# EAGLE design Addon-mapleCUx_OneWire-RS485-007 (EAGLE 7.6.0)
MAPLE-CUx Large Version
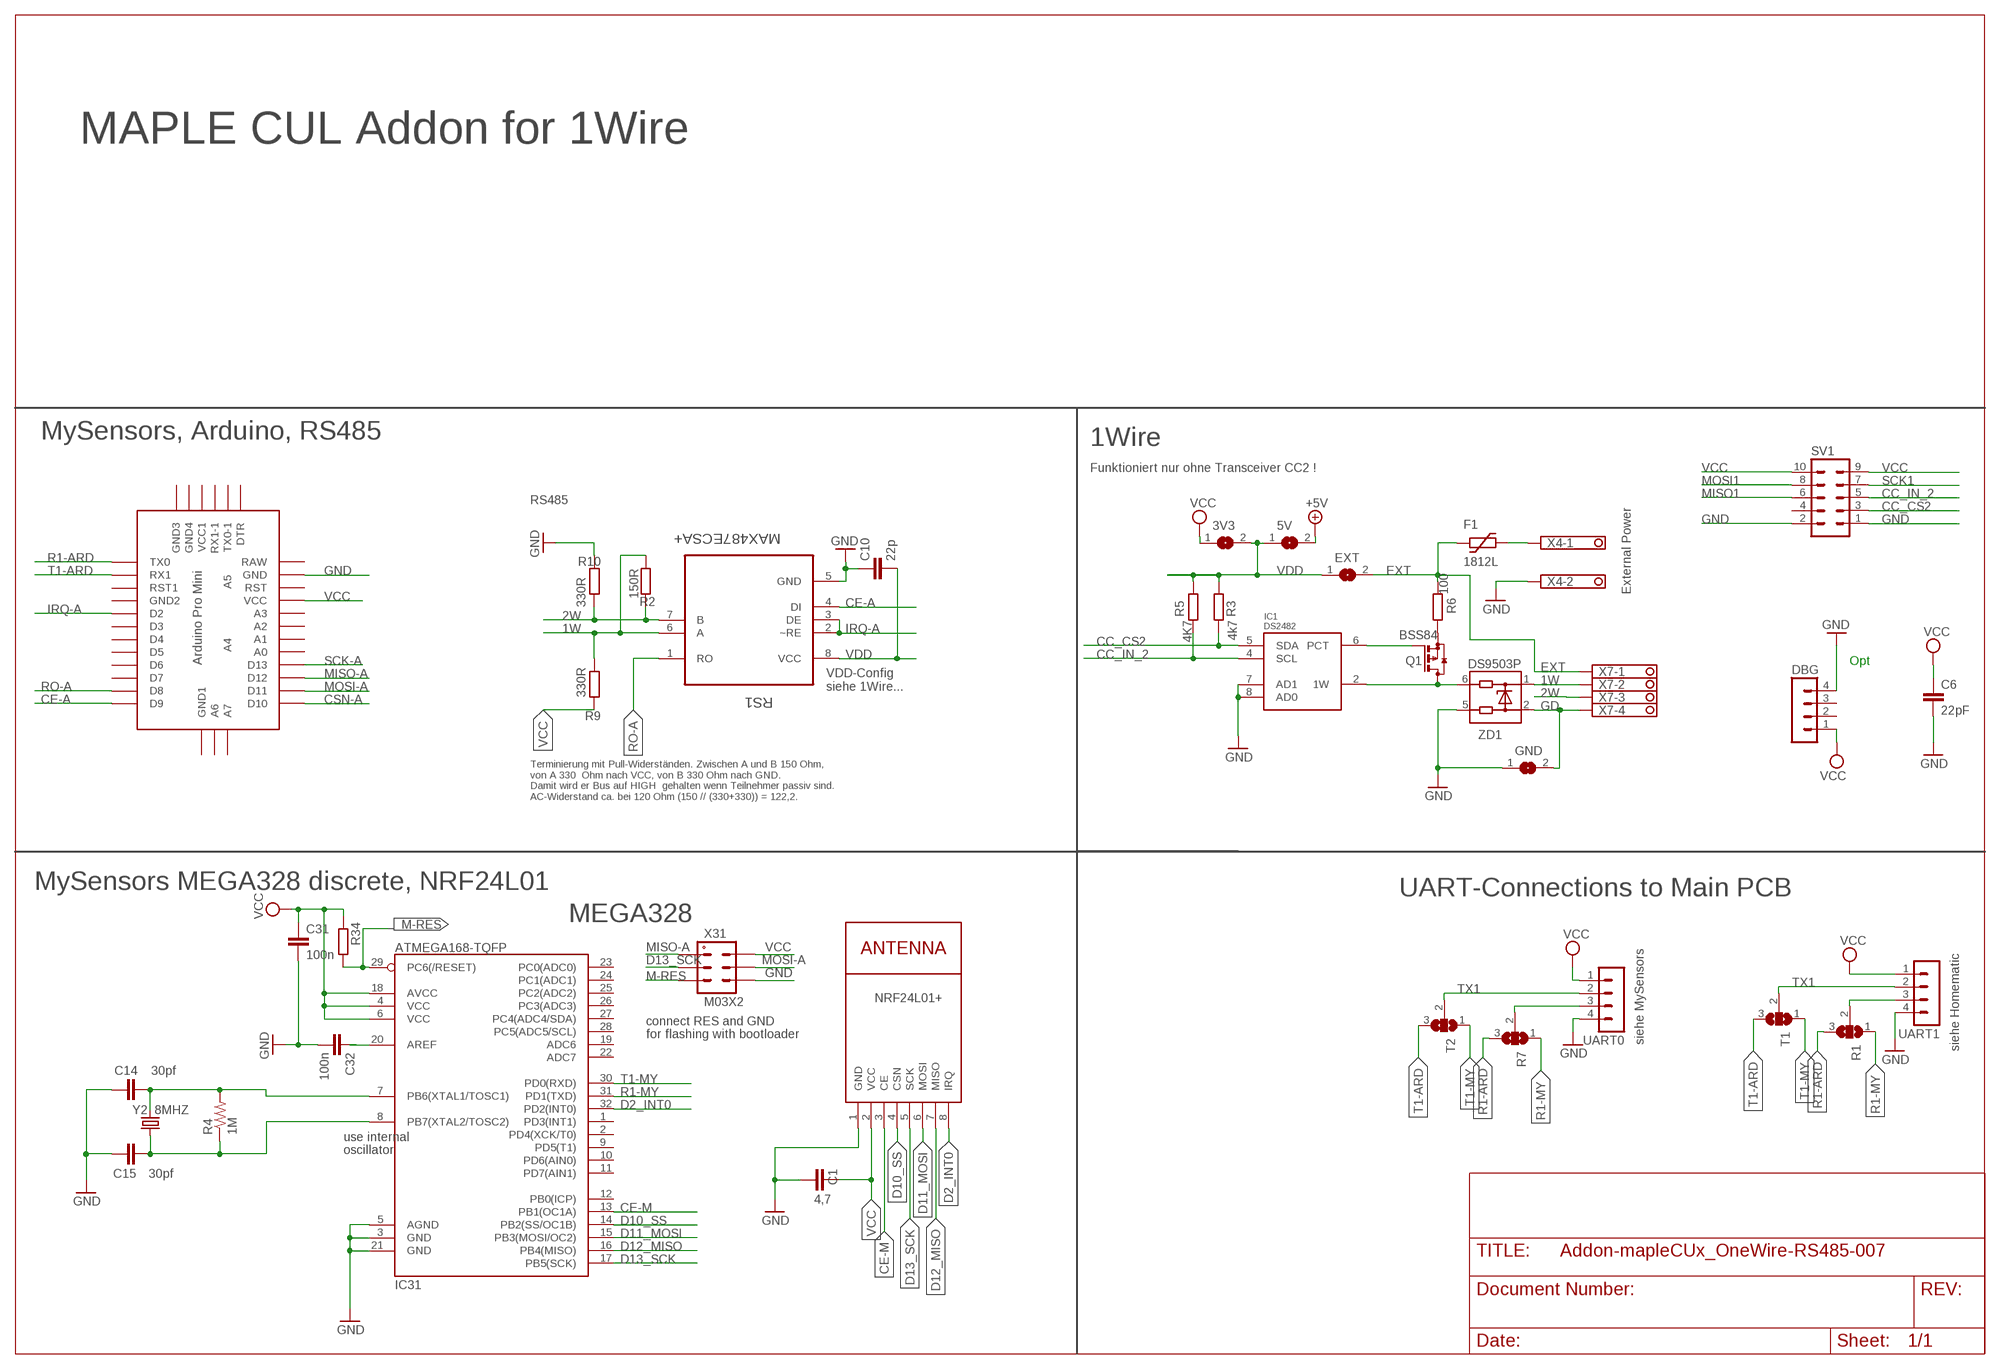
[diagram p0: schematic, sheet 1]

## Parts
3V3  SJ  [SJ]
5V  SJ  [SJ]
C1  4,7  C-EUC1210  [C1210]
C6  22pF  C-EUC0805  [C0805]
C10  22p  C-EUC0805  [C0805]
C14  30pf  CAP0805  [0805]
C15  30pf  CAP0805  [0805]
C31  100n  C-EUC0805  [C0805]
C32  100n  C-EUC0805  [C0805]
DBG  MA04-1  [MA04-1]
EXT  SJ  [SJ]
F1  1812L  [1812L]
GND  SJ  [SJ]
IC1  DS2482  DS2482-100S  [SO08]
IC31  ATMEGA168-TQFP  [TQFP32-08]
NRF24L01+  NRF24L01+  WIRELESS-NRF24L01  [WIRELESS-NRF24L01]
Q1  BSS84  [SOT23]
R1  SJ2W  [SJ_2]
R2  150R  R-EU_R0805  [R0805]
R3  4k7  R-EU_R0805  [R0805]
R4  1M  RESISTOR0805-RES  [0805]
R5  4K7  R-EU_R0805  [R0805]
R6  100  R-EU_R0805  [R0805]
R7  SJ2W  [SJ_2]
R9  330R  R-EU_R0805  [R0805]
R10  330R  R-EU_R0805  [R0805]
R34  R-EU_R0805  [R0805]
RS1  MAX487ECSA+  [SOIC127P600X175-8N]
SV1  MA05-2  [MA05-2]
T1  SJ2W  [SJ_2]
T2  SJ2W  [SJ_2]
U$1  ABK-PRO-MINI  [ABK-PRO-MINI]
UART0  MA04-1  [MA04-1]
UART1  MA04-1  [MA04-1]
X4  1751248  [1751248]
X7  1751264  [1751264]
X31  M03X2  [2X03-1.27MM_SMD]
Y2  8MHZ  CRYSTALTXC-7A  [CRYSTAL-TXC-7A]
ZD1  DS9503P  [TSOC6]

## Nets
1W: R2.1 R9.2 RS1.6(A) X7.2 ZD1.1
2W: R2.2 R10.1 RS1.7(B) X7.3
+5V [PWR]: 5V.2
CC_CS2: IC1.5(SDA) R3.2 SV1.3
CC_IN_2: IC1.4(SCL) R5.2 SV1.5
CE-A: RS1.4(DI) U$1.D9
CE-M: IC31.13(PB1(OC1A)) NRF24L01+.3(CE)
CSN-A: U$1.D10
D2_INT0: IC31.32(PD2(INT0)) NRF24L01+.8(IRQ)
D10_SS: IC31.14(PB2(SS/OC1B)) NRF24L01+.4(CSN)
D11_MOSI: IC31.15(PB3(MOSI/OC2)) NRF24L01+.6(MOSI)
D12_MISO: IC31.16(PB4(MISO)) NRF24L01+.7(MISO)
D13_SCK: IC31.17(PB5(SCK)) NRF24L01+.5(SCK) X31.P$3
EXT [PWR]: EXT.2 F1.P$1 R6.2 X7.1
GD [PWR]: GND.2 X7.4 ZD1.2
GND [PWR]: C1.1 C6.2 C10.1 C14.1 C15.1 C31.2 C32.2 DBG.4 GND.1 IC1.7(AD1) IC1.8(AD0) IC31.3(GND) IC31.5(AGND) IC31.21(GND) NRF24L01+.1(GND) R10.2 RS1.5(GND) SV1.1 SV1.2 U$1.GND UART0.4 UART1.4 X4.2 X31.P$6 ZD1.5
IRQ-A: RS1.2(~RE) RS1.3(DE) U$1.D2
M-RES: IC31.29(PC6(/RESET)) R34.2 X31.P$5
MISO1: SV1.6
MISO-A: U$1.D12 X31.P$1
MOSI1: SV1.8
MOSI-A: U$1.D11 X31.P$4
N$3: C14.2 IC31.7(PB6(XTAL1/TOSC1)) R4.2 Y2.P$2
N$13: C32.1 IC31.20(AREF)
N$19: C15.2 IC31.8(PB7(XTAL2/TOSC2)) R4.1 Y2.P$1
N$45 [PWR]: F1.P$2 X4.1
N$47: IC1.6(PCT) Q1.1(G)
N$48: IC1.2(1W) Q1.3(D) ZD1.6
N$52: Q1.2(S) R6.1
R1-ARD: R1.3 R7.3 U$1.TX0
R1-MY: IC31.31(PD1(TXD)) R1.1 R7.1
RO-A: RS1.1(RO) U$1.D8
RX1: R1.2 R7.2 UART0.3 UART1.3
SCK1: SV1.7
SCK-A: U$1.D13
T1-ARD: T1.3 T2.3 U$1.RX1
T1-MY: IC31.30(PD0(RXD)) T1.1 T2.1
TX1: T1.2 T2.2 UART0.2 UART1.2
VCC [PWR]: 3V3.1 C1.2 C6.1 C31.1 DBG.1 IC31.4(VCC) IC31.6(VCC) IC31.18(AVCC) R9.1 R34.1 SV1.9 SV1.10 U$1.VCC UART0.1 UART1.1 X31.P$2
VDD [PWR]: 3V3.2 5V.1 C10.2 EXT.1 R3.1 R5.1 RS1.8(VCC)
Unconnected: DBG.2 DBG.3 IC31.1(PD3(INT1)) IC31.2(PD4(XCK/T0)) IC31.9(PD5(T1)) IC31.10(PD6(AIN0)) IC31.11(PD7(AIN1)) IC31.12(PB0(ICP)) IC31.19(ADC6) IC31.22(ADC7) IC31.23(PC0(ADC0)) IC31.24(PC1(ADC1)) IC31.25(PC2(ADC2)) IC31.26(PC3(ADC3)) IC31.27(PC4(ADC4/SDA)) IC31.28(PC5(ADC5/SCL)) SV1.4 U$1.A0 U$1.A1 U$1.A2 U$1.A3 U$1.A4 U$1.A5 U$1.A6 U$1.A7 U$1.D3 U$1.D4 U$1.D5 U$1.D6 U$1.D7 U$1.DTR U$1.GND1(GND2) U$1.GND2(GND3) U$1.GND3(GND4) U$1.GND4(GND1) U$1.RAW U$1.RST U$1.RST1 U$1.RX1-1 U$1.TX0-1 U$1.VCC1

## Notes on the sheet
- MAPLE CUL Addon for 1Wire
- MySensors, Arduino, RS485 | 1Wire
- Funktioniert nur ohne Transceiver CC2 !
- RS485
- External Power
- Opt
- VDD-Config
  siehe 1Wire...
- Terminierung mit Pull-Widerständen. Zwischen A und B 150 Ohm,
  von A 330  Ohm nach VCC, von B 330 Ohm nach GND. 
  Damit wird er Bus auf HIGH  gehalten wenn Teilnehmer passiv sind.
  AC-Widerstand ca. bei 120 Ohm (150 // (330+330)) = 122,2.
- MySensors MEGA328 discrete, NRF24L01 | UART-Connections to Main PCB
- MEGA328
- connect RES and GND
- for flashing with bootloader
- siehe MySensors
- siehe Homematic
- use internal
- oscillator

## Power pins joined to a net without a drawn wire
GND: IC1.3(GND)
VCC: NRF24L01+.2(VCC)
VDD: IC1.1(VDD)

## Library data of the parts
3V3 5V EXT GND = jumper:SJ: SMD solder JUMPER
C1 C6 C10 C31 C32 = rcl:C-EU: CAPACITOR, European symbol
C14 C15 = doug:CAP: Capacitor Standard 0603 ceramic capacitor, and 0.1" leaded capacitor.
DBG UART0 UART1 = con-lstb:MA04-1: PIN HEADER; OC_FARNELL: unknown; OC_NEWARK: unknown
F1 = ptc-littlefuse:1812L
IC1 = 1wire:DS2482-100: I2C to 1-Wire Host Adapter/Line Driver This device is a onewire host and I2C interface in one chip. It provides the complete DC/AC requirements for onewire communication, including overdrive speed mode, but, unlike the DS2480B chip, no 12V EPROM programming. Notes: For overdrive speed and 5V EEPROM programming, an external active pullup circuit must be connected to the 1W, VDD and PCT pin. See the datasheet for details. The lower two I2C adress bits of the chip can be selected by external pins, so up to 4 chips may be connected to the same I2C bus. Author: Orginal device and description from Giovanni Varasano <giovanni.varasano@fastwebnet.it> Improved by Jan Kandziora <jjj@gmx.de>
IC31 = atmel:ATMEGA168: Atmel Atmega 168/328/328P
NRF24L01+ = diy-modules:WIRELESS-NRF24L01: 2.4 GHz Wireless Module based on NRF24L01 chip
Q1 = transistor-small-signal:BSS84: P-CHANNEL MOS FET
R1 R7 T1 T2 = jumper:SJ2W: SMD solder JUMPER
R2 R3 R5 R6 R9 R10 R34 = rcl:R-EU_: RESISTOR, European symbol
R4 = doug:RESISTOR: Resistor Basic schematic elements and footprints for 0603, 1206, and PTH resistors.
RS1 = Maxim_By_element14_Batch_1:MAX487ECSA+: Low-Power, Slew-Rate-Limited RS-485/RS-422 Transceivers; MPN: MAX487ECSA+; OC_FARNELL: 9724532; OC_NEWARK: 68K4803; PACKAGE: SOIC-8; SUPPLIER: Maxim
SV1 = con-lstb:MA05-2: PIN HEADER; OC_FARNELL: unknown; OC_NEWARK: unknown
U$1 = Arduino-clone:ABK-PRO-MINI: ABK Pro-Mini Arduino Clone
X4 = con-phoenix-350:1751248: MKDS 1/ 2-3,5 Printklemme Nennstrom: 10 A Bemessungsspannung: 160 V Raster: 3,5 mm Polzahl: 2 Montageart: Löten Anschlussart: Schraubanschluss Anschlussrichtung vom Leiter zur Platine: 0° Source: http://eshop.phoenixcontact.com .. 1751248.pdf; OC_FARNELL: unknown; OC_NEWARK: unknown
X7 = con-phoenix-350:1751264: MKDS 1/ 4-3,5 Printklemme Nennstrom: 10 A Bemessungsspannung: 160 V Raster: 3,5 mm Polzahl: 4 Montageart: Löten Anschlussart: Schraubanschluss Anschlussrichtung vom Leiter zur Platine: 0° Source: http://eshop.phoenixcontact.com .. 1751264.pdf; MPN: 1751264; OC_FARNELL: unknown; OC_NEWARK: 10R0934
X31 = mechanics:M03X2
Y2 = SparkFun-FreqCtrl:CRYSTAL: Various standard crystals. Proven footprints.
ZD1 = 1wire:DS9503: ESD Protection Diode with Resistors This ESD protection diode is designed especially for onewire host interfaces. Unlike the DS9502, it has two additional 5Ohm resitors in the 1W and GND line. Pin 5 and 6 have to be connected to the host side, pin 1 und 2 to the network side. The 1W line is through pin 1 and 6, the GND line is through pin 2 and 5. Author: Jan Kandziora <jjj@gmx.de>

## Net classes
0 default: width 0.305 mm
1 PWR: width 0.457 mm

## Board
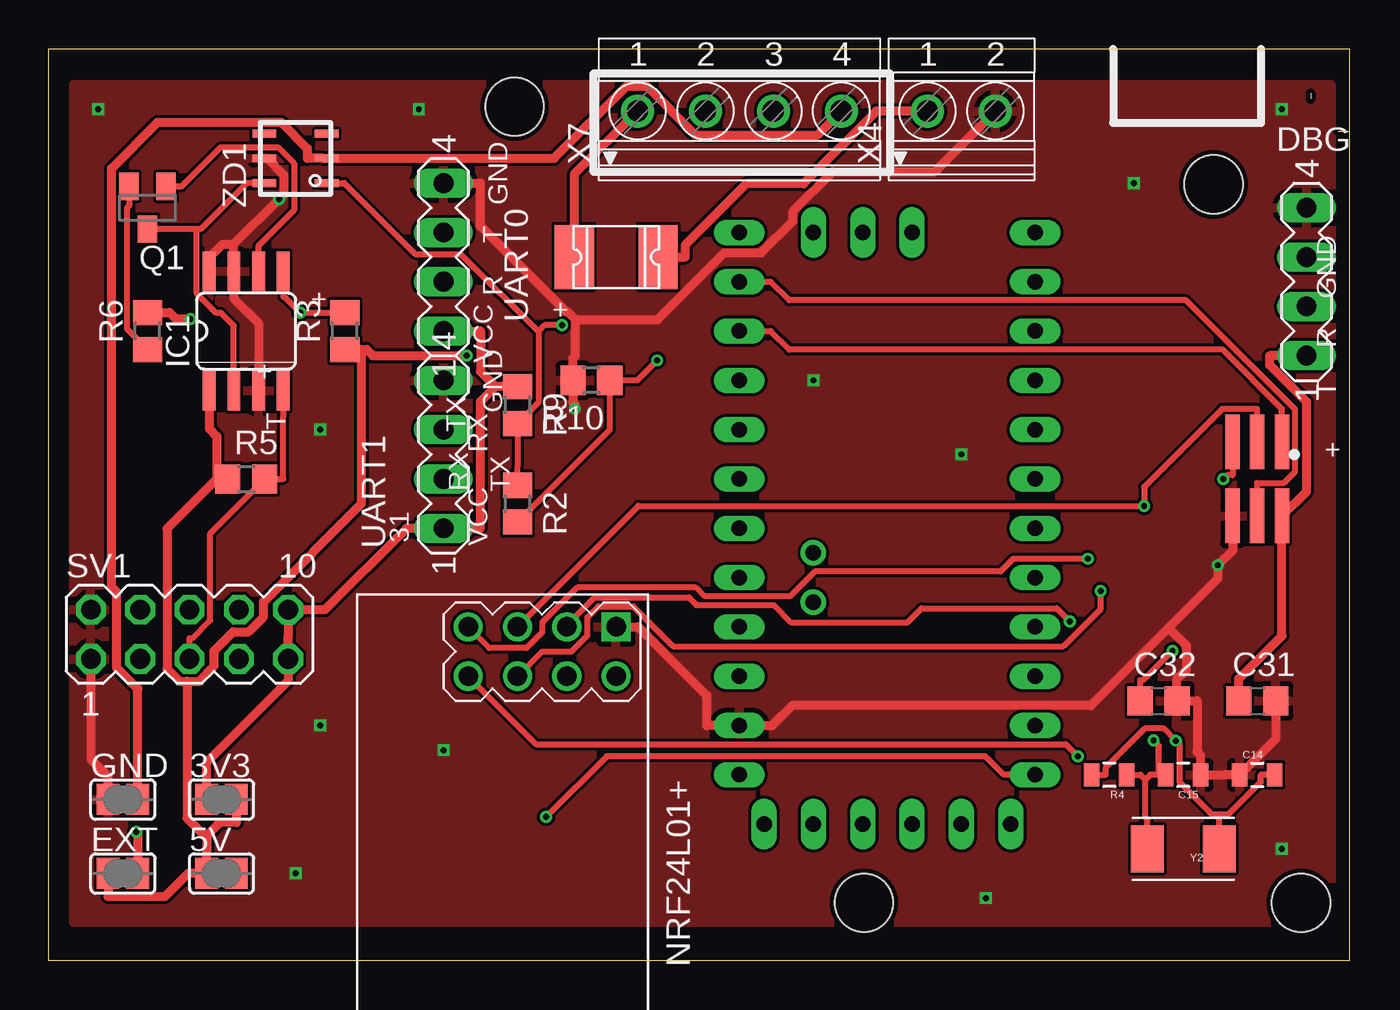
[diagram p1: board, top side]
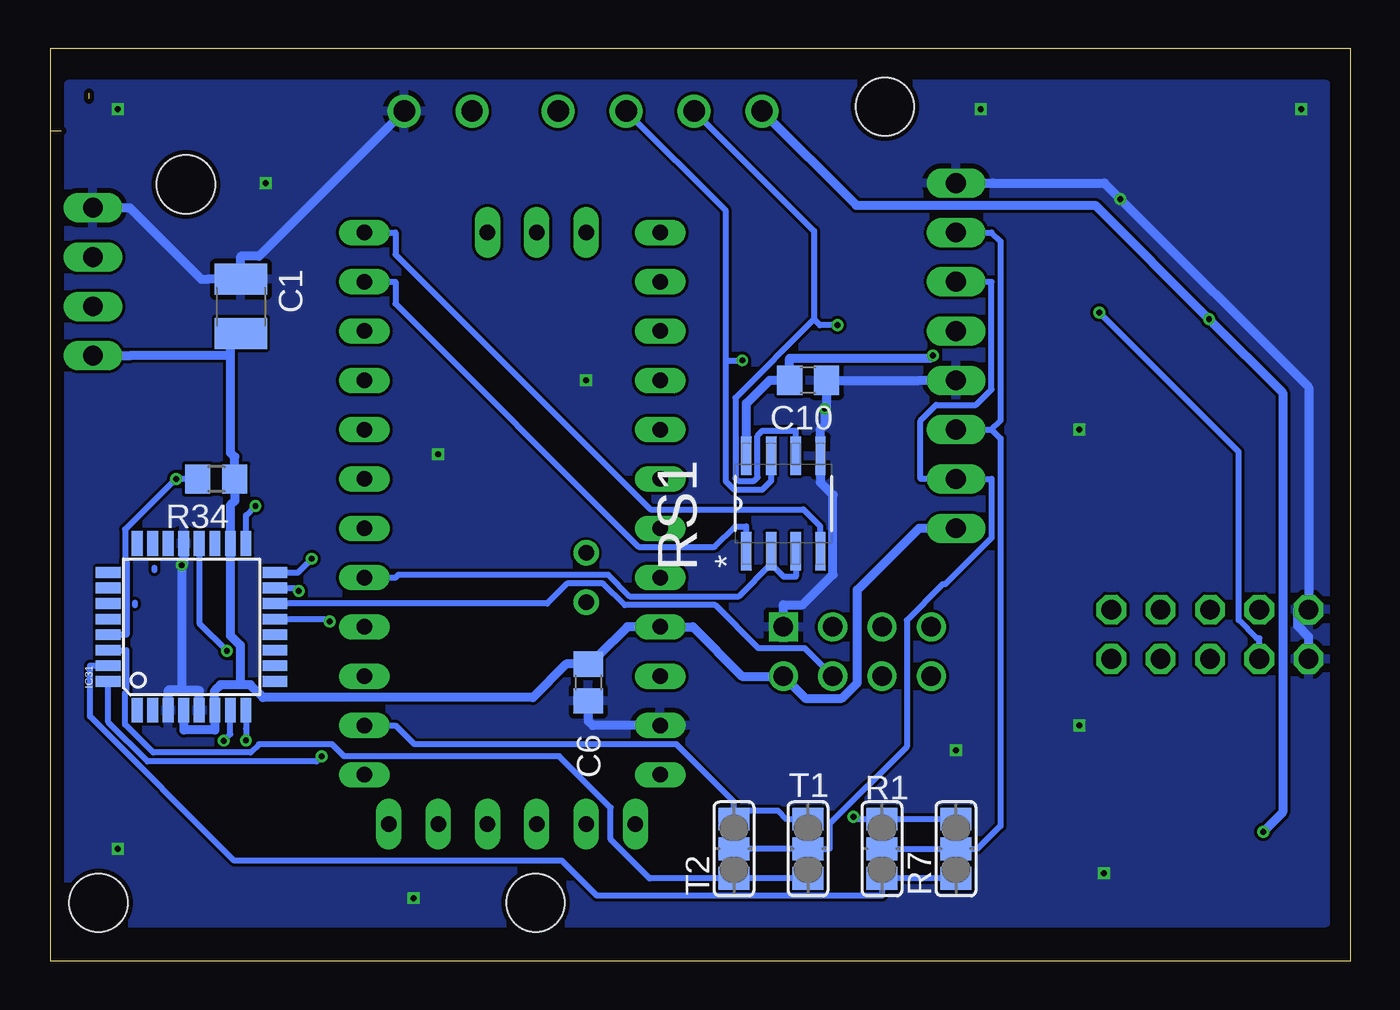
[diagram p2: board, bottom side, seen from below]

Size 67 x 47 mm. Coordinates in mm from the lower left corner, seen from the top.
Outline: 67,47 67,46.24
Outline: 65,44.7 65,44.41
Outline: 66.41,42.75 67,42.75
Outline: 67,47 0,47 0,0 67,0 67,42.75
Outline: 67,47 67,42.75
Copper layers (1*16): Top 0.035mm / dielectric 1.5mm / Bottom 0.035mm
Design rules "SeeedStudio_2layer_DRU_no_angle_20140221": minimum track width 6mil, minimum drill 12mil, track to track 6mil, track to pad 6mil, pad to pad 6mil, via to via 6mil, smd to smd 0mil, copper to edge 10mil, drill to drill 10mil, minimum pad ring 10mil, minimum via ring 6mil, stop-mask expansion 2mil, vias tented up to drill 100mil, thermal gap 10mil
Holes 3 mm at 60,40 24,44 42,3 64.5,3

### Footprints (pad centres in the part's own frame; a part is rotated, then mirrored left to right if it is on the bottom)
SJ = smd 1.168 x 1.6: 1 -0.762,0; 2 0.762,0
C1210 = smd 1.6 x 2.7: 1 -1.4,0; 2 1.4,0
C0805 = smd 1.3 x 1.5: 1 -0.95,0; 2 0.95,0
0805 = smd 0.8 x 1.2: 1 -0.9,0; 2 0.9,0
MA04-1 = drill 1.016 long: 1 -3.81,0; 2 -1.27,0; 3 1.27,0; 4 3.81,0
1812L = smd 2.03 x 3.3: P$1 -2.16,0; P$2 2.16,0
SO08 = smd 0.66 x 2.032: 1 -1.905,-3.073; 2 -0.635,-3.073; 3 0.635,-3.073; 4 1.905,-3.073; 5 1.905,3.073; 6 0.635,3.073; 7 -0.635,3.073; 8 -1.905,3.073
TQFP32-08 = smd 1.27 x 0.559: 1 -4.293,2.8; 2 -4.293,2; 3 -4.293,1.2; 4 -4.293,0.4; 5 -4.293,-0.4; 6 -4.293,-1.2; 7 -4.293,-2; 8 -4.293,-2.8; 17 4.293,-2.8; 18 4.293,-2; 19 4.293,-1.2; 20 4.293,-0.4; 21 4.293,0.4; 22 4.293,1.2; 23 4.293,2; 24 4.293,2.8 | smd 0.559 x 1.27: 9 -2.8,-4.293; 10 -2,-4.293; 11 -1.2,-4.293; 12 -0.4,-4.293; 13 0.4,-4.293; 14 1.2,-4.293; 15 2,-4.293; 16 2.8,-4.293; 25 2.8,4.293; 26 2,4.293; 27 1.2,4.293; 28 0.4,4.293; 29 -0.4,4.293; 30 -1.2,4.293; 31 -2,4.293; 32 -2.8,4.293
WIRELESS-NRF24L01 = drill 1 square: 1 -12.7,6.35 | drill 1: 2 -10.16,6.35; 3 -12.7,3.81; 4 -10.16,3.81; 5 -12.7,1.27; 6 -10.16,1.27; 7 -12.7,-1.27; 8 -10.16,-1.27
SOT23 = smd 1 x 1.4: 1 -0.95,-1.1; 2 0.95,-1.1; 3 0,1.1
SJ_2 = smd 1.168 x 1.6: 1 -1.524,0; 2 0,0; 3 1.524,0
R0805 = smd 1.3 x 1.5: 1 -0.95,0; 2 0.95,0
SOIC127P600X175-8N = smd 1.981 x 0.533: 1 -2.464,1.905; 2 -2.464,0.635; 3 -2.464,-0.635; 4 -2.464,-1.905; 5 2.464,-1.905; 6 2.464,-0.635; 7 2.464,0.635; 8 2.464,1.905
MA05-2 = drill 1.016 octagon: 1 -5.08,-1.27; 2 -5.08,1.27; 3 -2.54,-1.27; 4 -2.54,1.27; 5 0,-1.27; 6 0,1.27; 7 2.54,-1.27; 8 2.54,1.27; 9 5.08,-1.27; 10 5.08,1.27
ABK-PRO-MINI = drill 0.8 long: A0 10.16,-3.81; A1 10.16,-6.35; A2 10.16,-8.89; A3 10.16,-11.43; A6 3.81,-21.59; A7 6.35,-21.59; D2 -5.08,-3.81; D3 -5.08,-6.35; D4 -5.08,-8.89; D5 -5.08,-11.43; D6 -5.08,-13.97; D7 -5.08,-16.51; D8 -5.08,-19.05; D9 -5.08,-21.59; D10 10.16,-21.59; D11 10.16,-19.05; D12 10.16,-16.51; D13 10.16,-13.97; DTR 8.89,8.89; GND 10.16,3.81; GND1 -5.08,-1.27; GND2 -3.81,8.89; GND3 -1.27,8.89; GND4 1.27,-21.59; RAW 10.16,6.35; RST 10.16,1.27; RST1 -5.08,1.27; RX1 -5.08,3.81; RX1-1 3.81,8.89; TX0 -5.08,6.35; TX0-1 6.35,8.89; VCC 10.16,-1.27; VCC1 1.27,8.89 | drill 0.8: A4 6.35,-5.08; A5 6.35,-2.54
1751248 = drill 1.1 pad 1.7: 1 -1.75,-0.1; 2 1.75,-0.1
1751264 = drill 1.1 pad 1.7: 1 -5.25,-0.1; 2 -1.75,-0.1; 3 1.75,-0.1; 4 5.25,-0.1
2X03-1.27MM_SMD = smd 0.75 x 2.8: P$1 -1.27,-1.905; P$2 -1.27,1.905; P$3 0,-1.905; P$4 0,1.905; P$5 1.27,-1.905; P$6 1.27,1.905
CRYSTAL-TXC-7A = smd 1.7 x 2.4: P$1 1.85,0; P$2 -1.85,0
TSOC6 = smd 0.406 x 1.219: 1 -1.27,-1.6; 2 0,-1.6; 3 1.27,-1.6; 4 1.27,1.6; 5 0,1.6; 6 -1.27,1.6

### Placement (x,y rotation side)
3V3  8.91,8.32 0 top
5V  8.91,4.51 0 top
C1  57.17,33.72 270 bottom
C6  39.28,14.34 270 bottom
C10  27.96,29.91 180 bottom
C14  62.25,9.59 0 top
C15  58.44,9.59 180 top
C31  62.25,13.4 0 top
C32  57.17,13.4 0 top
DBG  64.79,34.99 90 top
EXT  3.83,4.51 0 top
F1  29.23,36.26 0 top
GND  3.83,8.32 0 top
IC1  10.18,32.45 0 top
IC31  59.71,17.21 90 bottom
NRF24L01+  22.88,4.51 270 top
Q1  5.1,38.8 180 top
R1  24.15,5.78 90 bottom
R2  24.15,23.56 270 top
R3  15.26,32.45 90 top
R4  54.63,9.59 180 top
R5  10.18,24.83 0 top
R6  5.1,32.45 90 top
R7  20.34,5.78 90 bottom
R9  24.15,28.64 270 top
R10  27.96,29.91 180 top
R34  58.44,24.83 180 bottom
RS1  29.23,23.56 90 bottom
SV1  7.26,16.83 0 top
T1  27.96,5.78 90 bottom
T2  31.77,5.78 90 bottom
U$1  45.74,15.94 180 top
UART0  20.34,36.26 90 top
UART1  20.34,26.1 90 top
X4  47.01,43.88 0 top
X7  35.58,43.88 0 top
X31  62.25,24.83 180 top
Y2  58.44,5.78 180 top
ZD1  12.72,41.34 90 top

### Tracks (layer width: path | path; a pad name or v marks a point on that pad's centre or on a via)
1W  (via drill 0.3 pad 0.61)
  Top 0.305: 25.23,32.43 25.23,28.77 R9.2 24.15,25.47 R2.1 | 25.23,32.43 21.23,36.42 18.88,36.42 15.23,40.07 ZD1.1 | v26.45,32.75 25.56,32.75 25.23,32.43
  Bottom 0.305: 27.66,33.05 31.71,29 31.71,24.87 31.56,24.73 30.74,24.73 30.56,24.91 30.56,27.06 30.31,27.32 28.59,27.32 RS1.6 | X7.2 27.66,37.6 27.66,33.05 | v26.45,32.75 27.35,32.75 27.66,33.05
2W  (via drill 0.3 pad 0.61)
  Top 0.305: v31.35,30.94 30.32,29.91 R10.1 28.91,27.37 R2.2
  Bottom 0.305: 32.19,30.94 32.19,38.64 X7.3 | 32.19,30.94 32.19,24.71 31.75,24.27 30.32,24.27 29.87,24.73 RS1.7 | 32.19,30.94 v31.35,30.94
CC_CS2  (via drill 0.3 pad 0.61)
  Top 0.305: R3.2 v12.96,33.4 12.16,34.2 12.09,34.2 IC1.5
  Bottom 0.305: SV1.3 4.72,16.63 4.85,16.63 5.79,17.56 5.79,26.23 v12.96,33.4
CC_IN_2
  Top 0.305: IC1.4 12.09,28.06 | 12.09,28.06 12.09,24.83 R5.2 8.33,22.03 8.33,17.56 7.39,16.63 7.26,16.63 SV1.5 | 12.09,28.06
CE-A
  Bottom 0.305: RS1.4 27.33,22.39 28.2,23.27 36.09,23.27 49.21,36.39 49.21,37.53 U$1.D9
CE-M  (via drill 0.3 pad 0.61)
  Top 0.305: NRF24L01+.3 26.69,17.3 28.12,18.73 32.97,18.73 33.37,18.33 37.35,18.33 38.23,17.45 44.25,17.45 44.96,18.17 51.92,18.17 v52.6,17.49
  Bottom 0.305: IC31.13 52.71,17.61 v52.6,17.49
D2_INT0  (via drill 0.3 pad 0.61)
  Top 0.305: NRF24L01+.8 25.11,11.17 52.38,11.17 v53,10.55
  Bottom 0.305: v53,10.55 53.27,10.28 61.98,10.28 64,12.3 IC31.32
D10_SS
  Bottom 0.305: NRF24L01+.4 28.12,16.1 30.5,16.1 32.73,18.33 37.39,18.33 38.51,19.44 40.37,19.44 41.4,18.41 IC31.14
D11_MOSI  (via drill 0.3 pad 0.61)
  Top 0.305: NRF24L01+.6 25.42,15.94 26.93,15.94 27.75,16.76 27.75,17.7 28.32,18.27 30.11,18.27 32.17,16.21 52.26,16.21 54.19,18.13 v54.19,19.06
  Bottom 0.305: v54.19,19.06 54.34,19.21 54.48,19.21 IC31.15
D12_MISO  (via drill 0.3 pad 0.61)
  Top 0.305: v53.52,20.72 49.68,20.72 49.02,20.06 39.46,20.06 38.19,18.79 33.79,18.79 33.34,19.24 27.22,19.24 25.42,17.44 25.42,16.93 24.61,16.11 22.71,16.11 NRF24L01+.7
  Bottom 0.305: v53.52,20.72 54.23,20.01 54.48,20.01 IC31.16
D13_SCK  (via drill 0.3 pad 0.61)
  Top 0.305: NRF24L01+.5 30.38,23.44 v56.42,23.44 56.42,24.42 60.44,28.44 62.25,28.44 X31.P$3
  Bottom 0.305: IC31.17 56.91,22.95 v56.42,23.44
EXT  (via drill 0.3 pad 0.61)
  Top 0.457: v4.52,6.66 4.59,6.59 EXT.2 | X7.1 27.07,40.52 F1.P$1 | R6.2 6.23,33.4 6.57,33.06 v7.31,33.06
  Bottom 0.457: v4.52,6.66 3.52,7.66 3.52,29.27 v7.31,33.06 13.17,38.93 25.48,38.93 X7.1
GD
  Top 0.457: X7.4 39.59,42.54 33.33,42.54 30.81,45.06 29.76,45.06 26.04,41.34 ZD1.2 14.17,41.34 13.33,41.34 13.33,41.85 11.98,43.19 5.62,43.19 3.24,40.82 3.24,19.27 3.51,19 3.51,15.11 4.59,14.02 GND.2
GND  (via drill 0.3 pad 0.61)
  Top 0.457: 57.68,17.16 58.61,16.22 58.61,15.02 58.12,14.53 C32.2 59.15,13.4 59.15,10.76 59.34,10.57 C15.1 60.57,9.59 C14.1 63.2,11.44 C31.2 | 57.68,17.16 53.68,13.16 38.3,13.16 37.27,12.13 U$1.GND 33.89,12.13 33.89,13.68 30.37,17.21 NRF24L01+.1 | v60.22,20.39 | v60.22,20.39 60.22,19.7 57.68,17.16 | 27.14,33.04 26.73,33.44 26.65,33.44 22.24,37.85 22.24,40.07 UART0.4 | 27.14,33.04 27.14,31.17 27.01,31.04 R10.2 27.01,28.78 27.1,28.69 v27.1,28.44 | 27.14,33.04 31.37,33.04 34.81,36.48 36.69,36.48 38.34,38.12 38.34,38.62 40.39,40.67 45.65,40.67 X4.2 | v60.22,20.39 60.98,21.14 X31.P$6 | 9.55,36.92 v11.87,39.25 12.11,39.49 12.11,40.49 11.26,41.34 ZD1.5 | 9.55,36.92 8.97,36.92 8.27,36.22 IC1.8 | 9.55,36.92 IC1.7 9.55,34.13 10.81,32.86 IC1.3 | GND.1 3.07,9.5 2.18,10.39 SV1.1
  Bottom 0.457: 60.22,13.95 60.89,13.95 60.91,13.93 IC31.3 | 60.22,13.95 60.2,13.93 59.31,13.93 IC31.5 | 60.22,13.95 v60.22,20.39 60.12,20.49 60.11,20.49 IC31.21 | X4.2 56.24,36.3 57.17,36.3 C1.1 58.9,35.12 59.2,35.12 62.89,38.8 DBG.4 | UART1.4 22.24,29.91 R10.2 27.01,28.54 v27.1,28.44 27.1,27.62 27.33,27.4 RS1.5 27.33,24.65 26.68,24 26.68,19.91 28.24,18.34 29.23,18.34 NRF24L01+.1 | UART0.4 18.44,40.07 12.69,40.07 v11.87,39.25 2.18,29.55 SV1.2 2.75,18.1 2.75,17.27 2.18,16.7 SV1.1 | C6.2 39.28,12.36 39.05,12.13 U$1.GND
  other vias: 2.56,43.88 19.07,43.88 13.99,27.37 12.72,4.51 20.34,10.86 39.39,29.91 47.01,26.1 55.9,40.07 63.52,5.78 48.28,3.24 13.99,12.13 63.52,43.88
  pour Bottom: 1.29,1.97 1.29,45.15 66.06,45.15 66.06,1.97
  pour Top: 1.29,1.97 1.29,45.15 66.06,45.15 66.06,1.97
IRQ-A
  Bottom 0.305: 29.87,20.45 31.53,18.79 37.14,18.79 38.26,19.9 49.06,19.9 49.21,19.75 U$1.D2 | 29.87,20.45 29.22,19.8 28.59,19.8 RS1.3 | RS1.2 29.87,20.45
M-RES  (via drill 0.3 pad 0.61)
  Top 0.305: X31.P$5 60.98,25.03 60.71,25.03 v60.51,24.83
  Bottom 0.305: IC31.29 63.06,16.81 63.06,20.56 63.13,20.63 63.13,22.23 60.53,24.83 v60.51,24.83 R34.2
MISO-A
  Top 0.305: U$1.D12 37.19,32.45 38.15,31.49 60.47,31.49 63.52,28.44 X31.P$1
MOSI-A
  Top 0.305: U$1.D11 37.19,34.99 38.15,34.03 58.58,34.03 64.2,28.41 64.2,25.21 63.62,24.63 62.25,24.63 X31.P$4
N$3  (via drill 0.3 pad 0.61)
  Top 0.305: 60.29,7.55 60.76,7.55 62.44,9.24 62.44,9.59 C14.2 | 60.29,7.55 59.91,7.55 58.25,9.22 58.25,11.16 v58.06,11.35 57.44,11.97 56.46,11.97 54.44,9.94 54.44,9.59 R4.2 | 60.29,7.55 60.29,6.53 Y2.P$2
  Bottom 0.305: v58.06,11.35 57.71,11.7 IC31.7
N$6
  Bottom 0.305: 62.61,18.32 62.61,18.45
N$9
  Bottom 0.305: 61.61,20.13 61.61,20.26
N$13  (via drill 0.3 pad 0.61)
  Top 0.305: C32.1 56.22,14.45 56.37,14.45 v57.89,15.98
  Bottom 0.305: IC31.20 59.31,17.4 v57.89,15.98
N$19  (via drill 0.3 pad 0.61)
  Top 0.305: 57.19,9.59 57.19,11.08 v56.91,11.36 | 57.19,9.59 56.83,9.59 56.74,9.59 56.49,9.34 | C15.2 57.19,9.59 | R4.1 55.88,9.59 56.23,9.59 56.49,9.34 | 56.49,9.34 56.49,7.39 56.59,7.29 Y2.P$1
  Bottom 0.305: v56.91,11.36 56.91,11.98 IC31.8
N$45
  Top 0.457: F1.P$2 32.79,36.26 32.79,36.87 35.95,40.03 38.89,40.03 42.63,43.78 X4.1
N$47
  Top 0.305: Q1.1 6.85,39.9 8.87,41.91 11.82,41.91 12.64,41.09 12.64,38.67 10.81,36.84 IC1.6
N$48
  Top 0.305: 7.64,37.7 7.64,34.38 8.64,33.38 8.89,33.38 9.55,32.72 9.55,30.7 IC1.2 | 7.64,37.7 Q1.3 | 7.64,37.7 7.84,37.7 10.2,40.07 ZD1.6
N$52
  Top 0.305: Q1.2 4.15,38.9 4.05,38.79 4.05,32.55 R6.1
R1-ARD  (via drill 0.3 pad 0.61)
  Top 0.305: U$1.TX0 49.21,9.59 48.25,10.55 28.75,10.55 v25.62,7.42
  Bottom 0.305: v25.62,7.42 25.51,7.3 25.26,7.3 R1.3 R7.3
R1-MY
  Bottom 0.305: R7.1 R1.1 24.15,3.37 38.84,3.37 40.63,5.16 57.51,5.16 64.94,12.6 64.94,15.21 IC31.31
RO-A
  Bottom 0.305: RS1.1 31.14,22.39 31.71,22.39 32.77,21.33 36.69,21.33 49.21,33.85 49.21,34.99 U$1.D8
RX1
  Bottom 0.305: 18.51,27.37 18.05,26.91 18.05,6.96 19.23,5.78 R7.2 R1.2 | 18.51,27.37 18.04,27.84 18.04,37.06 18.51,37.53 UART0.3 | UART1.3 18.51,27.37
T1-ARD
  Bottom 0.305: T1.3 29.06,7.3 29.51,7.75 31.77,7.75 | 31.77,7.75 31.77,8.19 34.75,11.17 48.25,11.17 49.21,12.13 U$1.RX1 | T2.3 31.77,7.75
T1-MY
  Bottom 0.305: IC31.30 63.06,16.01 63.06,13.86 63.13,13.79 63.13,12.19 61.68,10.74 56.67,10.74 56.24,11.17 52.48,11.17 51.86,10.55 40.78,10.55 38.12,7.89 38.12,6.26 36.12,4.26 T2.1 T1.1
TX1
  Bottom 0.305: UART0.2 18.51,34.99 18.51,29.44 19.31,28.64 21.37,28.64 22.17,27.84 22.17,24.83 UART1.2 20.04,24.83 18.51,24.83 18.51,21.79 20.91,19.4 21.03,19.4 22.88,17.55 22.88,11.03 26.85,7.06 26.85,5.78 T1.2 T2.2
VCC
  Top 0.457: DBG.1 62.89,31.18 62.89,30.71 64.79,28.8 64.79,24.2 X31.P$2 63.52,16.75 61.3,14.53 C31.1 | UART0.1 22.24,32.45 22.24,30.36 23.02,29.59 | R9.1 23.02,29.59 | 23.02,29.59 22.24,28.82 22.24,22.29 UART1.1 20.04,22.29 18.44,22.29 14.24,18.1 SV1.10 12.34,16.7 SV1.9 12.34,14.42 8.15,10.23 3V3.1
  Bottom 0.457: 57.2,14.23 57.2,16.26 57.71,16.77 IC31.18 57.71,23.48 57.49,23.7 R34.1 57.49,25.96 57.71,26.18 57.71,31.18 | 57.2,14.23 58.22,14.23 58.51,13.93 IC31.6 58.51,11.9 60.11,11.9 IC31.4 | 57.2,14.23 56.69,14.23 56.03,13.57 42.13,13.57 40.41,15.3 C6.1 39.28,15.48 39.28,15.7 38.77,15.7 37.27,17.21 U$1.VCC 33.89,17.21 31.35,14.67 NRF24L01+.2 28.09,13.53 26.22,13.53 25.42,14.33 25.42,19.11 22.24,22.29 UART1.1 | 57.71,31.18 57.71,32.32 C1.2 | 57.71,31.18 62.89,31.18 DBG.1
VDD  (via drill 0.3 pad 0.61)
  Top 0.457: EXT.1 3.07,3.33 6,3.33 7.18,4.51 5V.1 8.15,5.69 8.15,6.44 | 7.14,14.41 7.75,14.41 8.53,15.19 8.53,15.96 9.52,16.96 10.29,16.96 11.07,17.73 11.07,18.5 16.12,23.56 16.12,31.5 | 8.67,24.83 6.11,22.27 6.11,15.05 6.75,14.41 7.14,14.41 | 7.14,14.41 7.14,7.36 8.05,6.44 8.15,6.44 | 8.15,6.44 8.85,7.14 9.67,7.14 3V3.2 | 16.12,31.5 16.39,31.5 16.71,31.18 v21.52,31.18 | R3.1 16.12,31.5 | IC1.1 8.27,27.42 8.67,27.03 8.67,24.83 | R5.1 8.67,24.83
  Bottom 0.457: v21.52,31.18 21.66,31.04 28.91,31.04 C10.2 29.94,29.91 31.14,28.72 RS1.8

### Text on the board
tNames: GND | T | R | + | GND | + | GND | R | VCC | + | T | T | TX | + | RX | RX | TX | 31 | VCC
bNames: Ant3